# EAGLE design ASL1201 (EAGLE 6.3)
DATABASE: ./../../../../../Components/TinyCircuits_Part_Database.txt
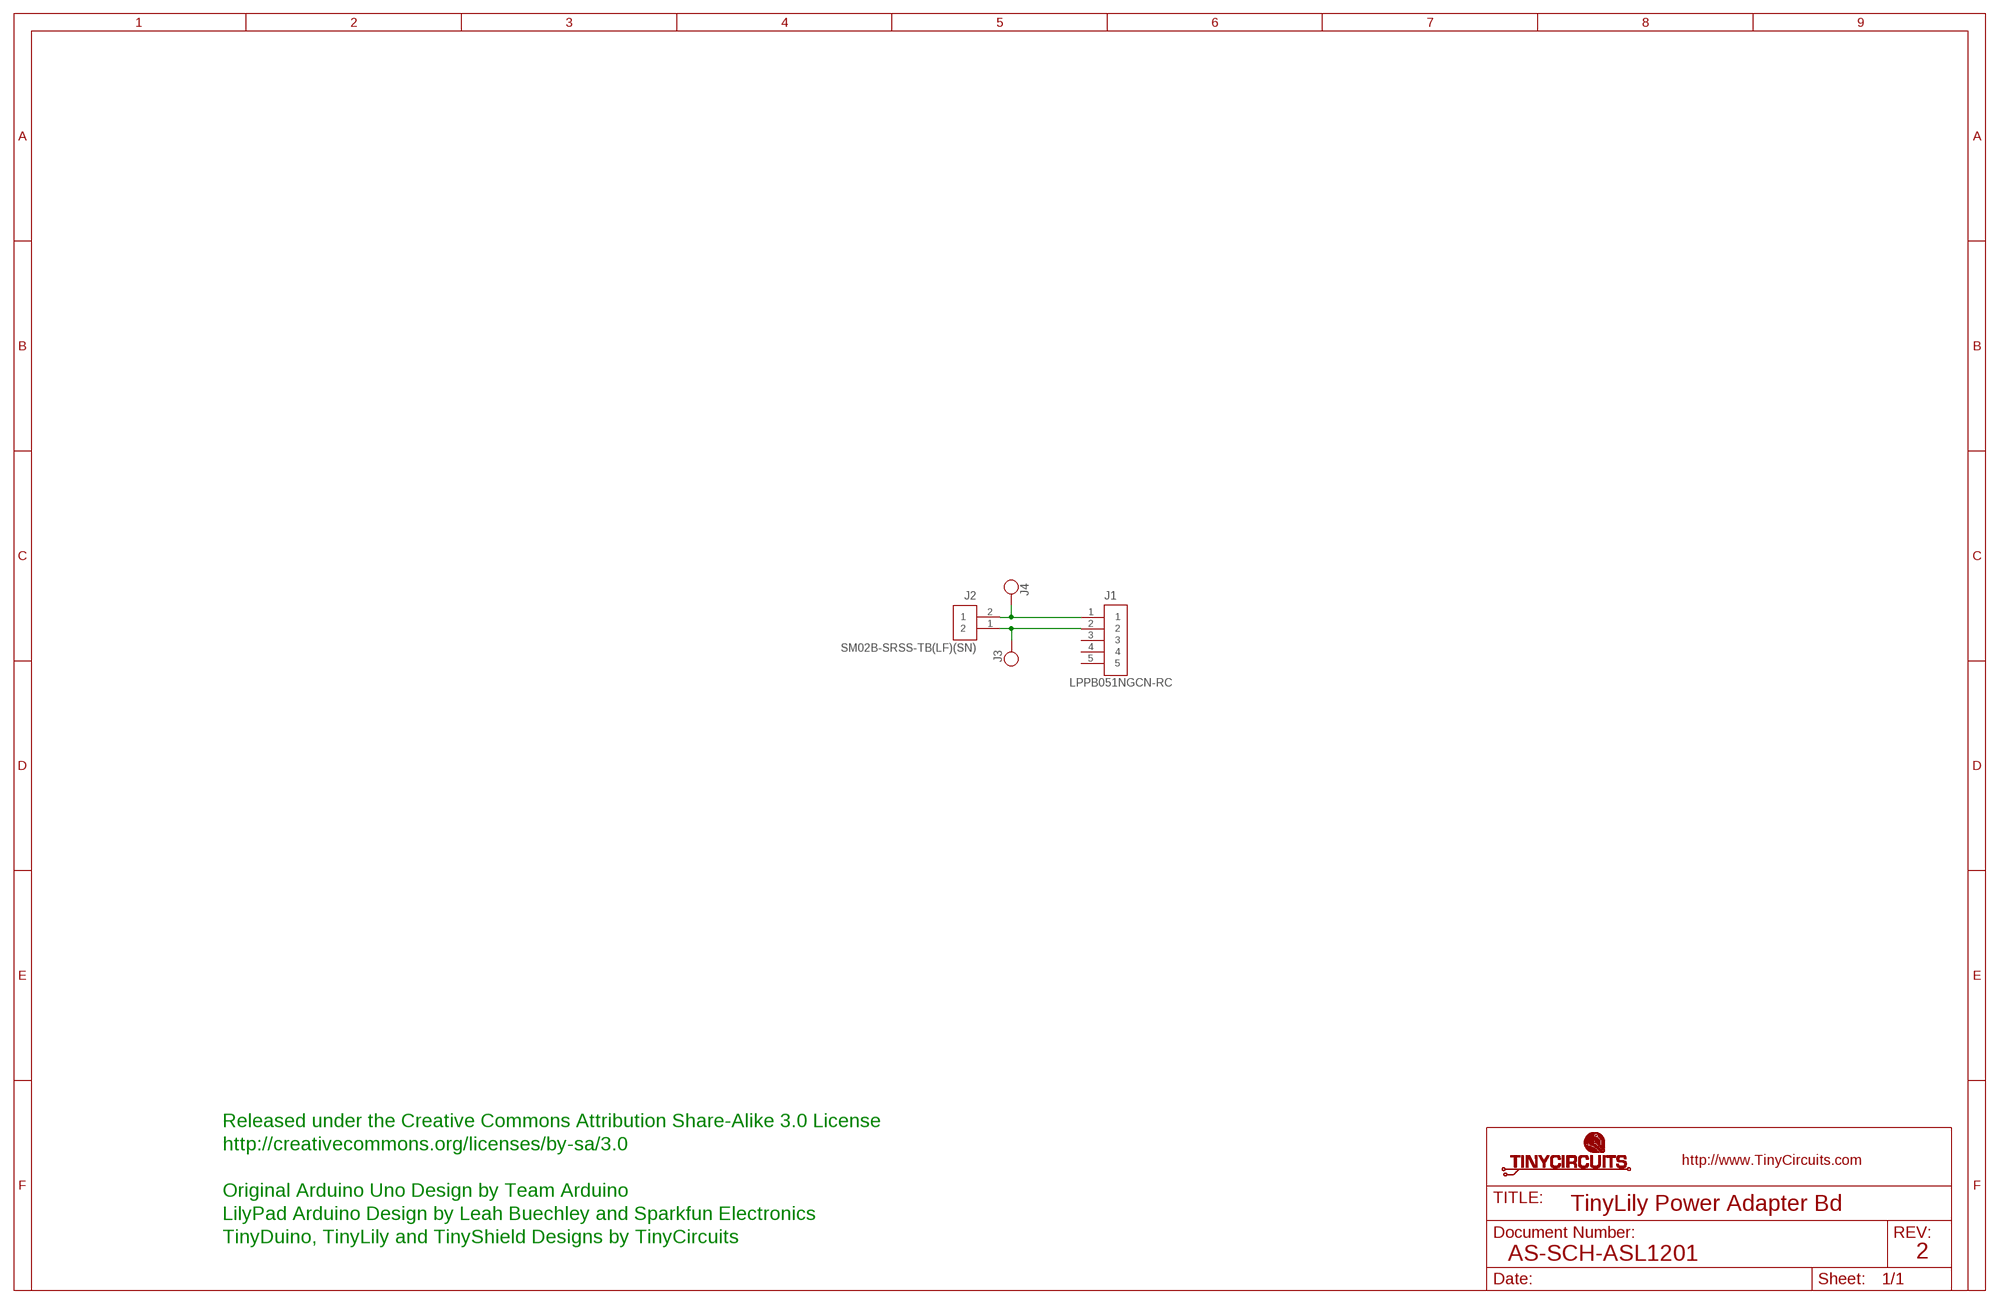
[diagram p0: schematic, sheet 1]

## Parts
J1  LPPB051NGCN-RC  AS-ITM-00037  [1X5_.05_RA_TH_RECPT]
J2  SM02B-SRSS-TB(LF)(SN)  AS-ITM-00231  [JST_SH_2X1]
J3  PIN_1X.1"1  [1X.1"_2]
J4  PIN_1X.1"1  [1X.1"_2]

## Nets
N$1: J1.1 J2.2 J4.1
N$2: J1.2 J2.1 J3.1
Unconnected: J1.3 J1.4 J1.5

## Notes on the sheet
- Released under the Creative Commons Attribution Share-Alike 3.0 License
- http://creativecommons.org/licenses/by-sa/3.0
- Original Arduino Uno Design by Team Arduino
- TinyLily Power Adapter Bd
- LilyPad Arduino Design by Leah Buechley and Sparkfun Electronics
- TinyDuino, TinyLily and TinyShield Designs by TinyCircuits
- AS-SCH-ASL1201 | 2

## Library data of the parts
J1 = tinycircuits:AS-ITM-00037: CONN HEADER .050" 5POS TH RA RECPT; PARTNO: AS-ITM-00037
J2 = tinycircuits:AS-ITM-00231: CONN HEADER SH 2POS SIDE 1MM; PARTNO: AS-ITM-00231
J3 J4 = tinycircuits:PIN_1X.1": 1 Pin 0.100" Header

## Net classes
2 gnd: width 0.305 mm, drill 0.559 mm, clearance 0.254 mm

## Board
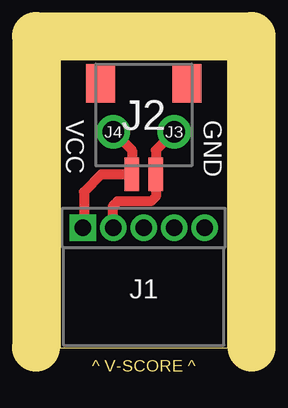
[diagram p1: board, top side]
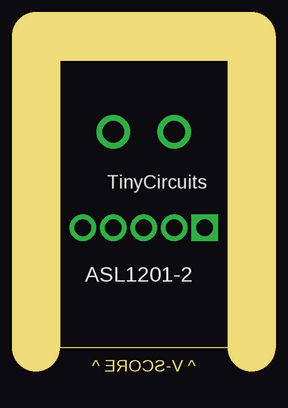
[diagram p2: board, bottom side, seen from below]

Size 7 x 12 mm. Coordinates in mm from the lower left corner, seen from the top.
Outline: 0,0 7,0 7,12 0,12 0,0
Copper layers (1*16): Top 0.035mm / dielectric 1.5mm / Bottom 0.035mm
Design rules "default": minimum track width 8mil, minimum drill 15mil, track to track 6mil, track to pad 6mil, pad to pad 6mil, via to via 6mil, smd to smd 6mil, copper to edge 6mil, drill to drill 8mil, minimum pad ring 8mil, minimum via ring 5mil, stop-mask expansion 4mil, vias tented up to drill 25mil, thermal gap 10mil
Milling: 3 lines

### Footprints (pad centres in the part's own frame; a part is rotated, then mirrored left to right if it is on the bottom)
1X5_.05_RA_TH_RECPT = drill 0.7 pad 1.016 square: 1 0,2.54 | drill 0.7 pad 1.016: 2 0,1.27; 3 0,0; 4 0,-1.27; 5 0,-2.54
JST_SH_2X1 = smd 0.6 x 1.4: 1 -0.5,2.475; 2 0.5,2.475 | smd 1.2 x 1.6: PAD1 -1.8,-1.325; PAD2 1.8,-1.325
1X.1"_2 = drill 0.889 pad 1.397: 1 0,0

### Placement (x,y rotation side)
J1  3.5,5 90 top
J2  3.5,9.7 180 top
J3  4.77,9 0 top
J4  2.23,9 0 top
U$1  [DOCFIELD-TINYCIRCUITS-PCB]  27.5,-13 0 top  (outside the outline)

### Tracks (layer width: path | path; a pad name or v marks a point on that pad's centre or on a via)
N$1
  Top 0.406: J4.1 3,8.23 J2.2 1.73,7.23 1,6.5 1,5.04 J1.1
N$2
  Top 0.406: J3.1 4,8.23 J2.1 4,6.3 3.8,6.1 2.4,6.1 2.2,5.9 2.2,5.03 J1.2

### Text on the board
Dimension: ^ V-SCORE ^
tPlace: VCC | GND
bPlace: TinyCircuits | ASL1201-2
Document: FABRICATION DRAWING | NOTES: | 1. PRINTED CIRCUIT BOARD MADE FROM NEMA GRADE FR-4 EPOXY LAMINATE | WITH 1 OUNCE COPPER PLATING AND .024 THICKNESS. | 2. ALL DIMENSIONS ARE GIVEN IN INCHES. | 3. CIRCUIT PATHS ARE FOR REFERENCE ONLY. | 4. HOLE SIZES SHOWN ARE FINISHED DIAMETERS AFTER PLATING. | 5. BOARD PLATED USING REFLOW OR SIMILAR METHOD. | 6. BOARD TO HAVE BLUE SOLDER MASK ON PLATED SURFACES USING WET FILM | 7. SILKSCREEN BOARD USING WHITE INK. | SR100 OR SR1010 EPOXY. EQUIVALENT WET OR DRY FILM MAY BE USED. | 8. THE FOLLOWING INFORMATION APPLIES TO THIS BOARD: | * 2 COPPER LAYERS | * .024 BOARD THICKNESS | * REQUIRES TOP SIDE SILKSCREEN | Released under the Creative Commons Attribution Share-Alike 3.0 License | http://creativecommons.org/licenses/by-sa/3.0 | Original Arduino Uno Design by Team Arduino | LilyPad Arduino Design by Leah Buechley and Sparkfun Electronics | TinyDuino, TinyLily and TinyShield Designs by TinyCircuits | TinyLily Power Adapter Bd | AS-PCB-ASL1201 | 2